# EasyEDA schematic 1-Schematic_Line Following.json
TITLE: Sheet_1; REV: 1.0; Date: 2025-02-20; Sheet: 1/1; Drawn By: ffugycerise; Company: Your Company
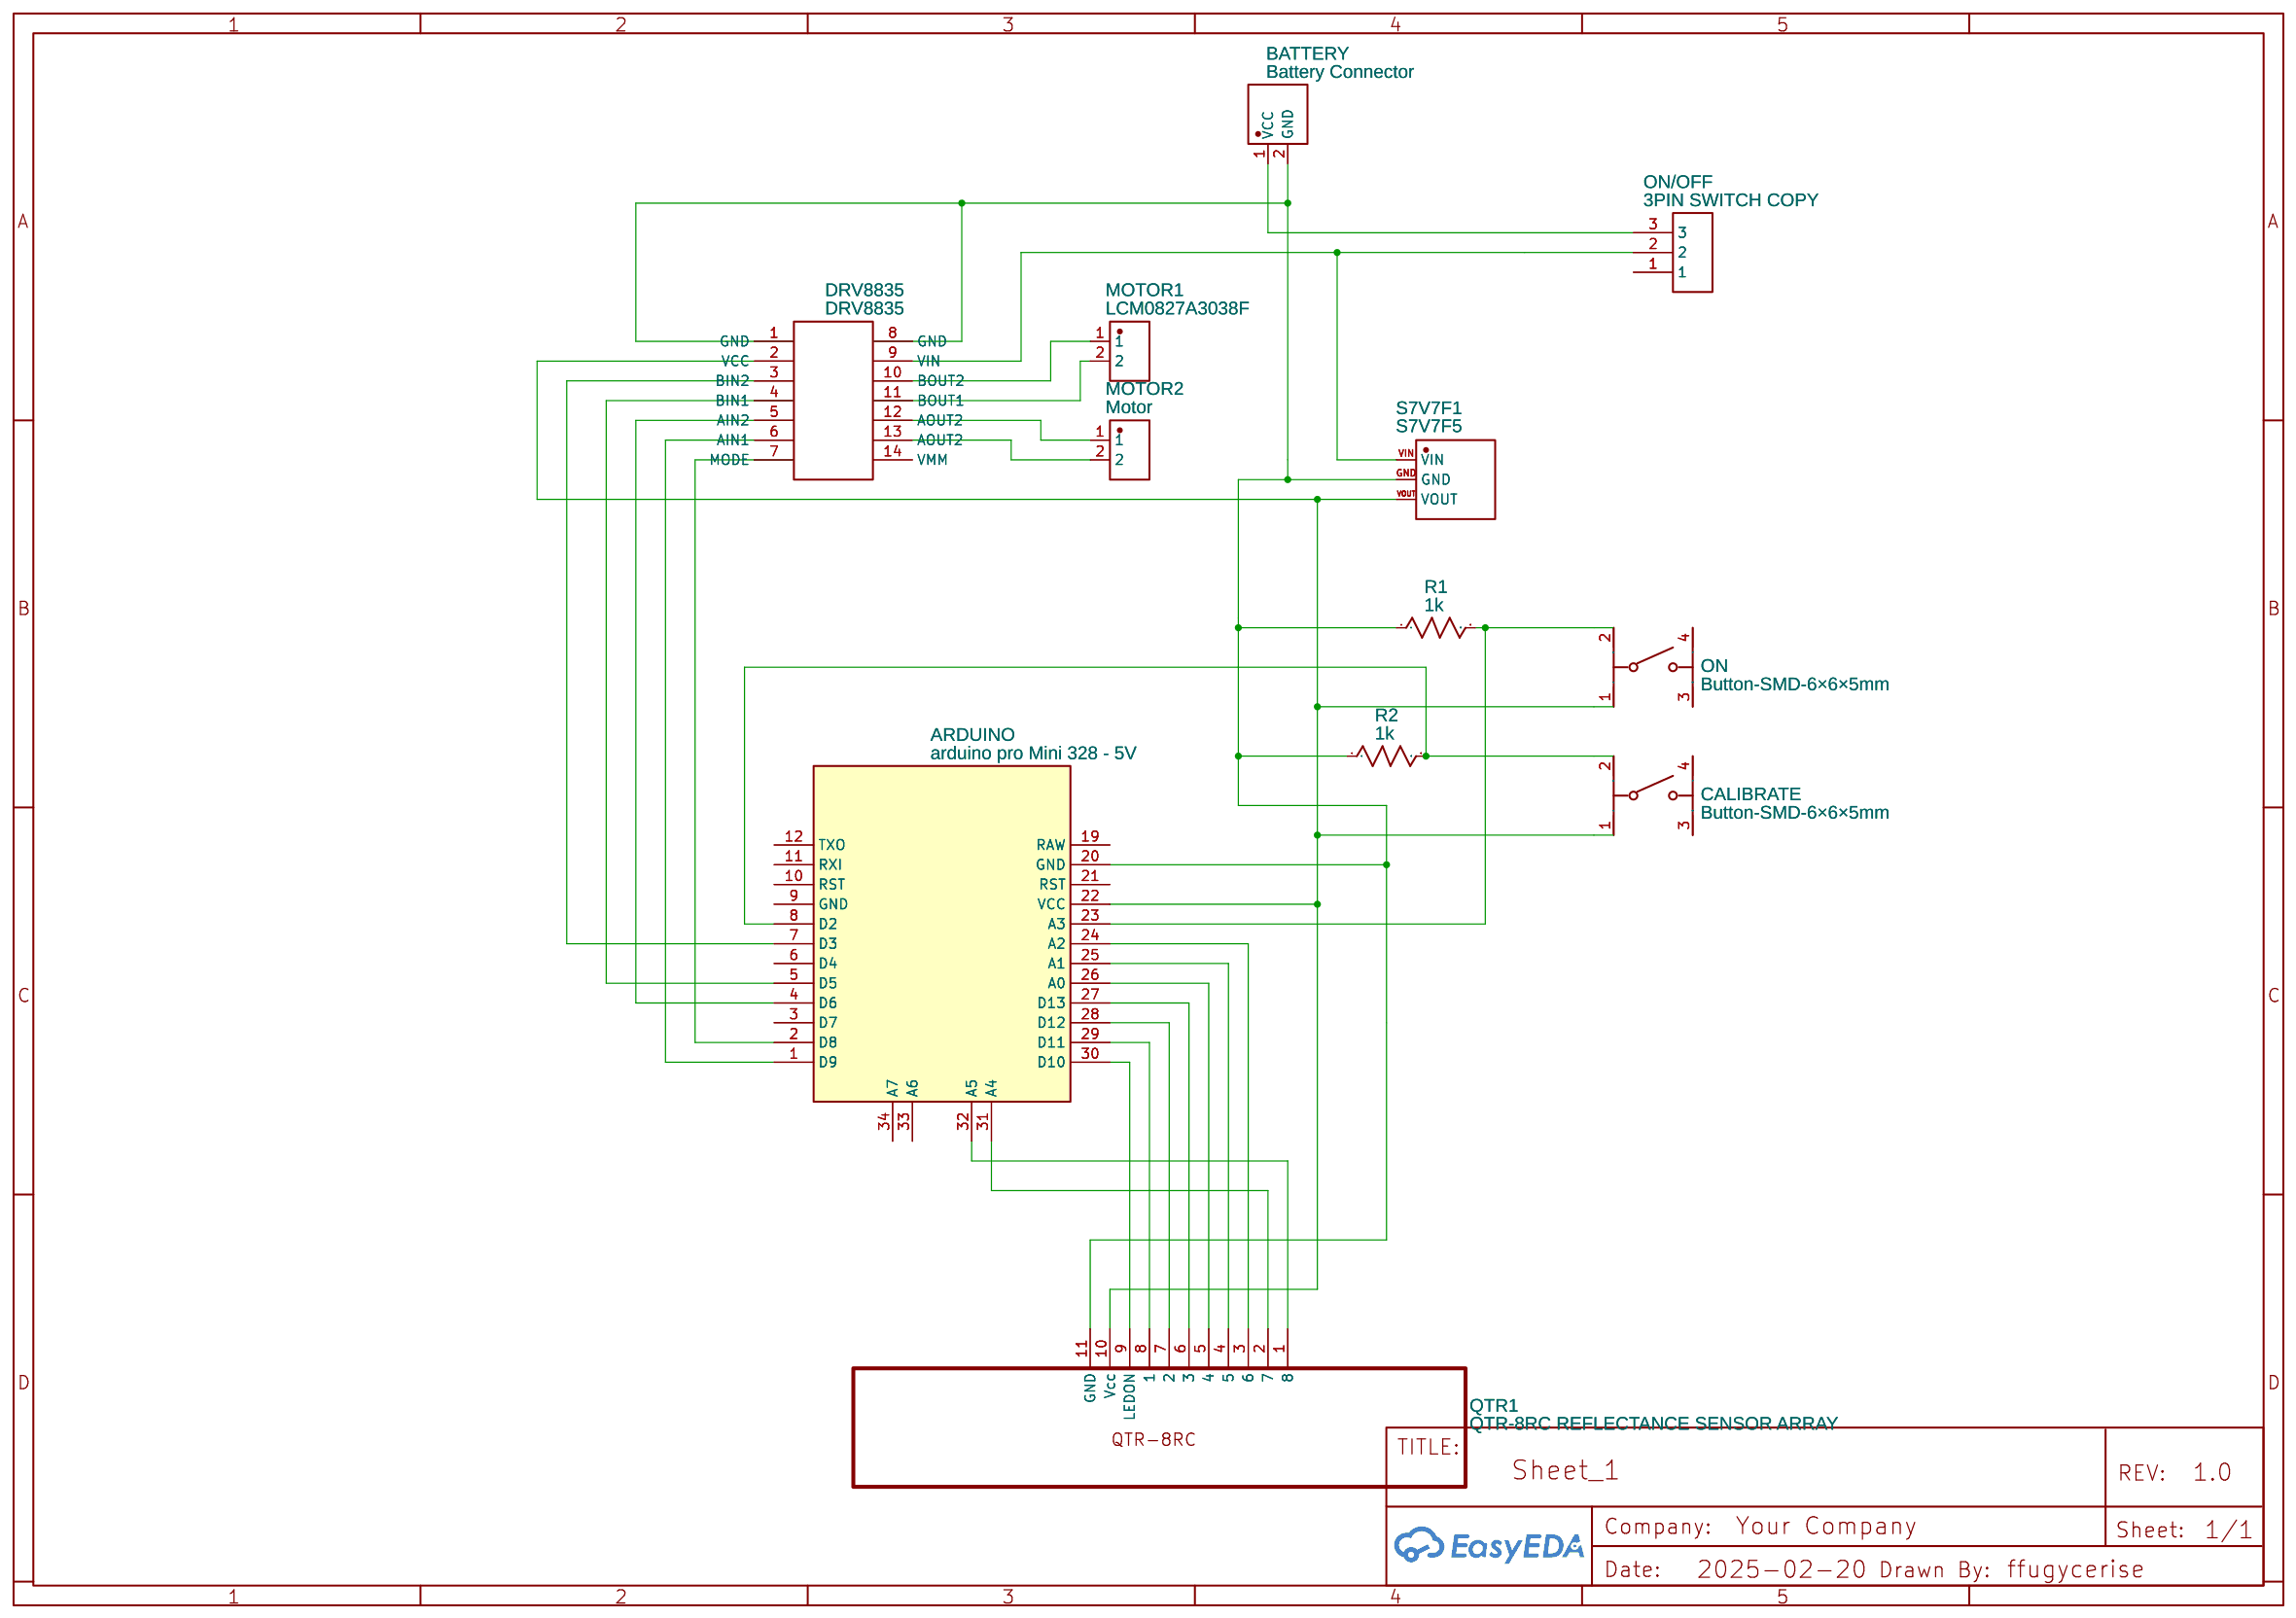
[diagram p0: schematic sheet]

## Parts
ARDUINO  arduino pro Mini 328 - 5V  [ARDUINO PRO MINI 328 - 5V NO PROGRAM]
BATTERY  Battery Connector  [BATTERY CONNECTOR]
CALIBRATE  Button-SMD-6×6×5mm  [SW-SMD_4P-L6.0-W6.0-P4.50-LS8.2]
DRV8835  DRV8835  [DRV8835]
MOTOR1  LCM0827A3038F  [VIBRATIONMOTOR-TH_LCM0827A3038F]
MOTOR2  Motor  [VIBRATIONMOTOR-TH_LCM0827A3038F]
ON  Button-SMD-6×6×5mm  [SW-SMD_4P-L6.0-W6.0-P4.50-LS8.2]
ON/OFF  3PIN SWITCH COPY  [BENDING PIN MINI TOGGLE SWITCH (1P2T) SPDT SLIDE SWITCH 50V]
QTR1  QTR-8RC REFLECTANCE SENSOR ARRAY  [QTR-8RC REFLECTANCE SENSOR ARRAY]
R1  1k  [R0603]
R2  1k  [R0603]
S7V7F1  S7V7F5  [S7V7F5]

## Library data of the parts
ARDUINO = arduino pro Mini 328 - 5V: sourceId: 1T5FDZYC8; Contributor: Kitchacircuit
BATTERY = Battery Connector: Contributor: ahmadsyafiq559
CALIBRATE ON = Button-SMD-6×6×5mm: Supplier: LCSC; Manufacturer: null; Manufacturer Part: 6×6×5mm 环保（嘉立创）; Supplier Part: C21456; JLCPCB Part Class: Extended Part
DRV8835 = DRV8835: Manufacturer: Pololu; Supplier: Pololu; Supplier Part: DRV8835 Dual Motor Driver Carrier; link: https://www.pololu.com/product/2135/resources; Contributor: pwe4225
MOTOR1 MOTOR2 = LCM0827A3038F: Supplier: LCSC; Supplier Part: C2759981; Manufacturer: LEADER(立得); JLCPCB Part Class: Extended Part; Contributor: lcsc
ON/OFF = 3PIN SWITCH COPY: Manufacturer: Dongguan Kaifeng Electronic Technology Limited; Manufacturer Part: SS12D06; Supplier: Alibaba; Supplier Part: SS12D06; link: https://www.alibaba.com/product-detail/KaiFeng-SS12D06-Three-Wrestling-Pin-Slide_62168688714.html?spm=a2700.7724838.2017115.14.2697ec44KNew8q; Contributor: Peter Story; Link: https://www.alibaba.com/product-detail/KaiFeng-SS12D06-Three-Wrestling-Pin-Slide_62168688714.html?spm=a2700.7724838.2017115.14.2697ec44KNew8q; Price: $0.06; subpart_no: 1
QTR1 = QTR-8RC REFLECTANCE SENSOR ARRAY: Manufacturer Part: 961; Contributor: PiterSantaCruz; Supplier Part: 961; Supplier: Pololu; Manufacturer: Pololu; link: https://www.pololu.com/product/961
R1 R2 = R_0603_US: Contributor: LCEDA_Lib
S7V7F1 = S7V7F5: Contributor: kamil23571113

## Nets
Net-(ARDUINO-1): ARDUINO.1(D9) DRV8835.6(AIN1)
Net-(ARDUINO-2): ARDUINO.2(D8) DRV8835.7(MODE)
Net-(ARDUINO-4): ARDUINO.4(D6) DRV8835.5(AIN2)
Net-(ARDUINO-5): ARDUINO.5(D5) DRV8835.4(BIN1)
Net-(ARDUINO-7): ARDUINO.7(D3) DRV8835.3(BIN2)
Net-(ARDUINO-8): ARDUINO.8(D2) CALIBRATE.2 R2.2
Net-(ARDUINO-20): ARDUINO.20(GND) BATTERY.2(GND) DRV8835.1(GND) DRV8835.8(GND) QTR1.11(GND) R1.1 R2.1 S7V7F1.GND
Net-(ARDUINO-22): ARDUINO.22(VCC) CALIBRATE.1 DRV8835.2(VCC) ON.1 QTR1.10(Vcc) S7V7F1.VOUT
Net-(ARDUINO-23): ARDUINO.23(A3) ON.2 R1.2
Net-(ARDUINO-24): ARDUINO.24(A2) QTR1.3(6)
Net-(ARDUINO-25): ARDUINO.25(A1) QTR1.4(5)
Net-(ARDUINO-26): ARDUINO.26(A0) QTR1.5(4)
Net-(ARDUINO-27): ARDUINO.27(D13) QTR1.6(3)
Net-(ARDUINO-28): ARDUINO.28(D12) QTR1.7(2)
Net-(ARDUINO-29): ARDUINO.29(D11) QTR1.8(1)
Net-(ARDUINO-30): ARDUINO.30(D10) QTR1.9(LEDON)
Net-(ARDUINO-31): ARDUINO.31(A4) QTR1.2(7)
Net-(ARDUINO-32): ARDUINO.32(A5) QTR1.1(8)
Net-(BATTERY-1): BATTERY.1(VCC) ON/OFF.3
Net-(DRV8835-9): DRV8835.9(VIN) ON/OFF.2 S7V7F1.VIN
Net-(DRV8835-10): DRV8835.10(BOUT2) MOTOR1.1
Net-(DRV8835-11): DRV8835.11(BOUT1) MOTOR1.2
Net-(DRV8835-12): DRV8835.12(AOUT2) MOTOR2.1
Net-(DRV8835-13): DRV8835.13(AOUT2) MOTOR2.2

Not connected (* = marked no-connect by the designer): ARDUINO 3(D7) 6(D4) 9(GND) 10(RST) 11(RXI) 12(TXO) 19(RAW) 21(RST) 33(A6) 34(A7); CALIBRATE 3 4; DRV8835 14(VMM); ON 3 4; ON/OFF 1
